# Altium schematic sheet Sheet3.SchDoc
size A4
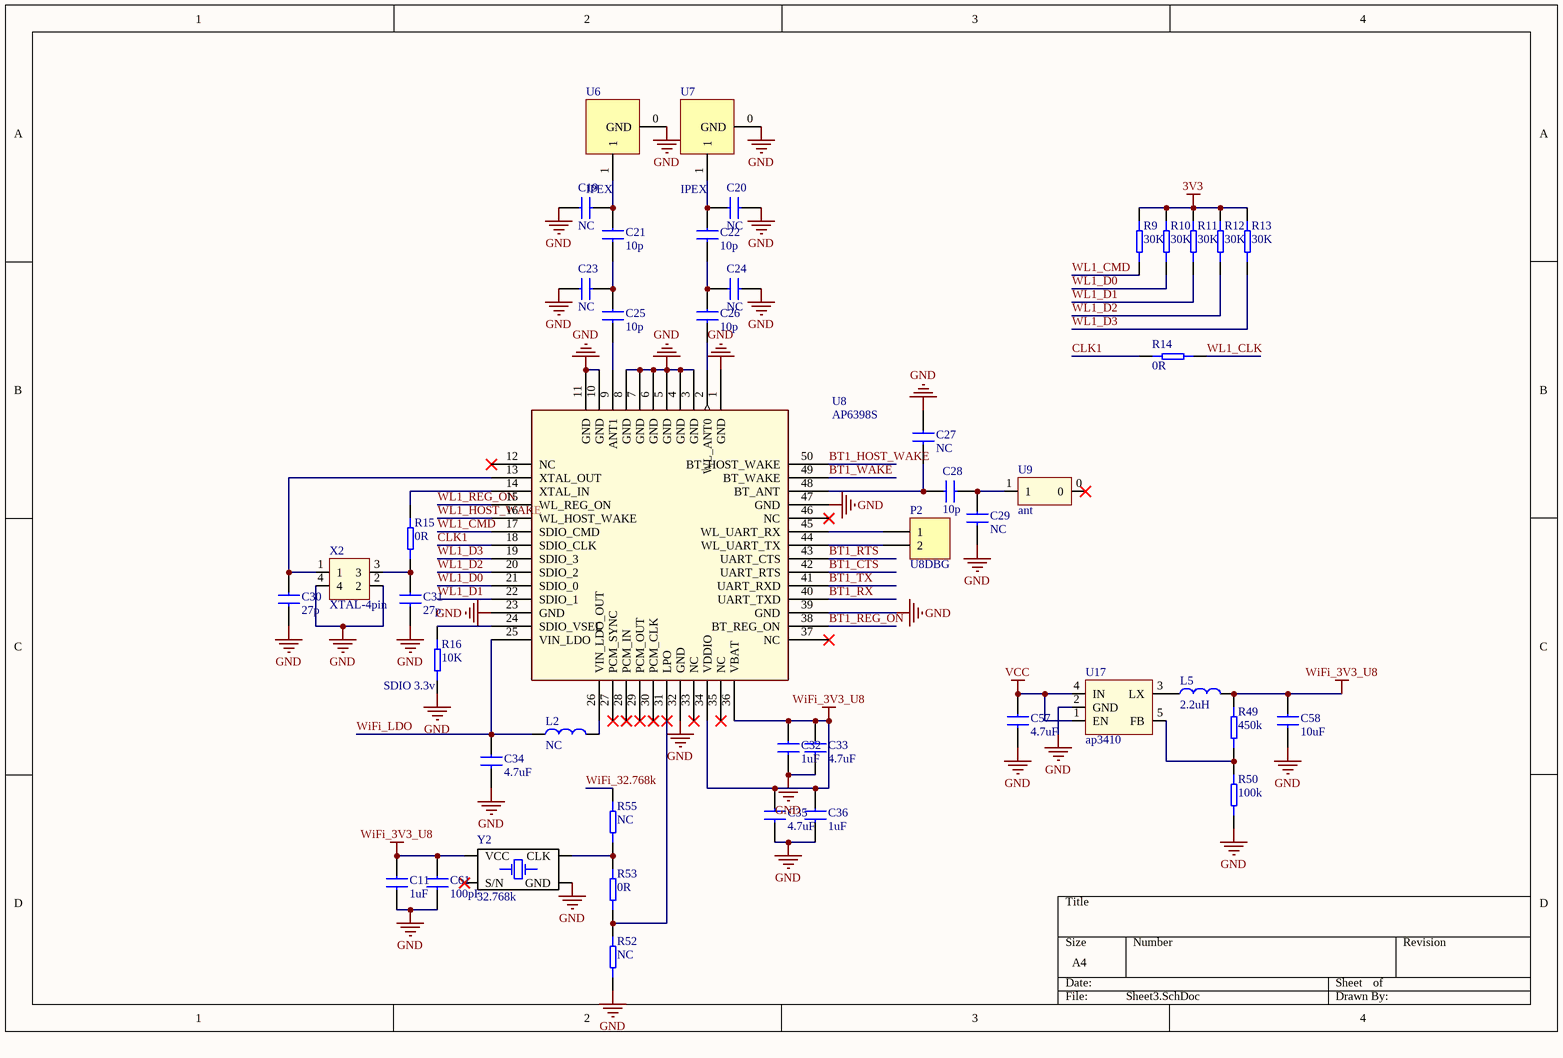
[diagram p0: Sheet3.SchDoc]

## Parts
C11  1uF  [0402C]
C19  NC  [0402C]
C20  NC  [0402C]
C21  10p  [0402C]
C22  10p  [0402C]
C23  NC  [0402C]
C24  NC  [0402C]
C25  10p  [0402C]
C26  10p  [0402C]
C27  NC  [0402C]
C28  10p  [0402C]
C29  NC  [0402C]
C30  27p  [0402C]
C31  27p  [0402C]
C32  1uF  [0402C]
C33  4.7uF  [0402C]
C34  4.7uF  [0603C]
C35  4.7uF  [0402C]
C36  1uF  [0402C]
C57  4.7uF  [0603C]
C58  10uF  [0603C]
C61  100pF  [0402C]
L2  NC  [0805R]
L5  2.2uH  [0805R]
P2  U8DBG  [MHDR1X2]
R9  30K  [0402R]
R10  30K  [0402R]
R11  30K  [0402R]
R12  30K  [0402R]
R13  30K  [0402R]
R14  0R  [0402R]
R15  0R  [0402R]
R16  10K  [0402R]
R49  450k  [0402R]
R50  100k  [0402R]
R52  NC  [0402R]
R53  0R  [0402R]
R55  NC  [0402R]
U6  IPEX  [IPEX]
U7  IPEX  [IPEX]
U8  AP6398S  [ap6398sr3]
U9  ant  [AN9520]
U17  ap3410  [LC-SOT-23-5]
X2  XTAL-4pin  [LC-SMD-3225_4P]
Y2  32.768k  [3225]

## Nets
3V3: R9.2 R10.2 R11.2 R12.2 R13.2
GND: C11.2 C19.1 C20.2 C23.1 C24.2 C27.1 C29.2 C30.2 C31.2 C32.2 C33.2 C34.1 C35.2 C36.2 C57.2 C58.2 C61.2 R16.1 R50.1 R52.1 U6.0(GND) U7.0(GND) U8.1(GND) U8.3(GND) U8.4(GND) U8.5(GND) U8.6(GND) U8.7(GND) U8.8(GND) U8.10(GND) U8.11(GND) U8.23(GND) U8.32(GND) U8.39(GND) U8.47(GND) U17.2(GND) X2.2 X2.4 Y2.2(GND)
VCC: C57.1 U17.1(EN) U17.4(IN)
WiFi_3V3_U8: C11.1 C32.1 C33.1 C35.1 C36.1 C58.1 C61.1 L5.1 R49.2 U8.34(VDDIO) U8.36(VBAT) Y2.4(VCC)
BT1_CTS: U8.42(UART_RTS)
BT1_HOST_WAKE: U8.50(BT_HOST_WAKE)
BT1_REG_ON: U8.38(BT_REG_ON)
BT1_RTS: U8.43(UART_CTS)
BT1_RX: U8.40(UART_TXD)
BT1_TX: U8.41(UART_RXD)
BT1_WAKE: U8.49(BT_WAKE)
CLK1: R14.2 U8.18(SDIO_CLK)
WiFi_32.768k: R55.2
WiFi_LDO: C34.2 L2.2 U8.25(VIN_LDO)
WL1_CLK: R14.1
WL1_CMD: R9.1 U8.17(SDIO_CMD)
WL1_D0: R10.1 U8.21(SDIO_0)
WL1_D1: R11.1 U8.22(SDIO_1)
WL1_D2: R12.1 U8.20(SDIO_2)
WL1_D3: R13.1 U8.19(SDIO_3)
WL1_HOST_WAKE: U8.16(WL_HOST_WAKE)
WL1_REG_ON: U8.15(WL_REG_ON)
NetC19_2: C19.2 C21.2 U6.1
NetC20_1: C20.1 C22.1 U7.1
NetC21_1: C21.1 C23.2 C25.1
NetC22_2: C22.2 C24.1 C26.1
NetC25_2: C25.2 U8.9(ANT1)
NetC26_2: C26.2 U8.2(WL_ANT0)
NetC27_2: C27.2 C28.1 U8.48(BT_ANT)
NetC28_2: C28.2 C29.1 U9.1
NetC30_1: C30.1 U8.13(XTAL_OUT) X2.1
NetC31_1: C31.1 R15.1 X2.3
NetL2_1: L2.1 U8.26(VIN_LDO_OUT)
NetL5_2: L5.2 U17.3(LX)
NetP2_1: P2.1 U8.45(WL_UART_RX)
NetP2_2: P2.2 U8.44(WL_UART_TX)
NetR15_2: R15.2 U8.14(XTAL_IN)
NetR16_2: R16.2 U8.24(SDIO_VSEL)
NetR49_1: R49.1 R50.2 U17.5(FB)
NetR52_2: R52.2 R53.1 U8.31(LPO)
NetR53_2: R53.2 R55.1 Y2.3(CLK)

Not connected (* = marked no-connect by the designer): U8 12(NC)* 27(PCM_SYNC)* 28(PCM_IN)* 29(PCM_OUT)* 30(PCM_CLK)* 33(NC)* 35(NC)* 37(NC)* 46(NC)*; U9 0*; Y2 1(S/N)*

## Notes on the sheet
- (near R16) SDIO 3.3v

## Library data of the parts
C11 C19-C36 C57 C58 C61 = CAP: SMD-CAP
L2 = L1: LQM2MPN2R2NG0L
L5 = L1: LQM2MPN3R3NG0L
P2 = MHDR1X2: Header, 2-Pin; LatestRevisionDate: 17-Jul-2002; LatestRevisionNote: Re-released for DXP Platform.; Publisher: Altium Limited
R9-R16 R49 R50 R52 R53 R55 = R
X2 = XTAL-4pin: 37.4MHz
Y2 = XATL1: 3225 有源